# Altium schematic sheet [04] - SX1276.SchDoc: EE-02 - LoRa (SX1276)
size A3; DocumentNumber: 5; SheetNumber: 5; SheetTotal: 5
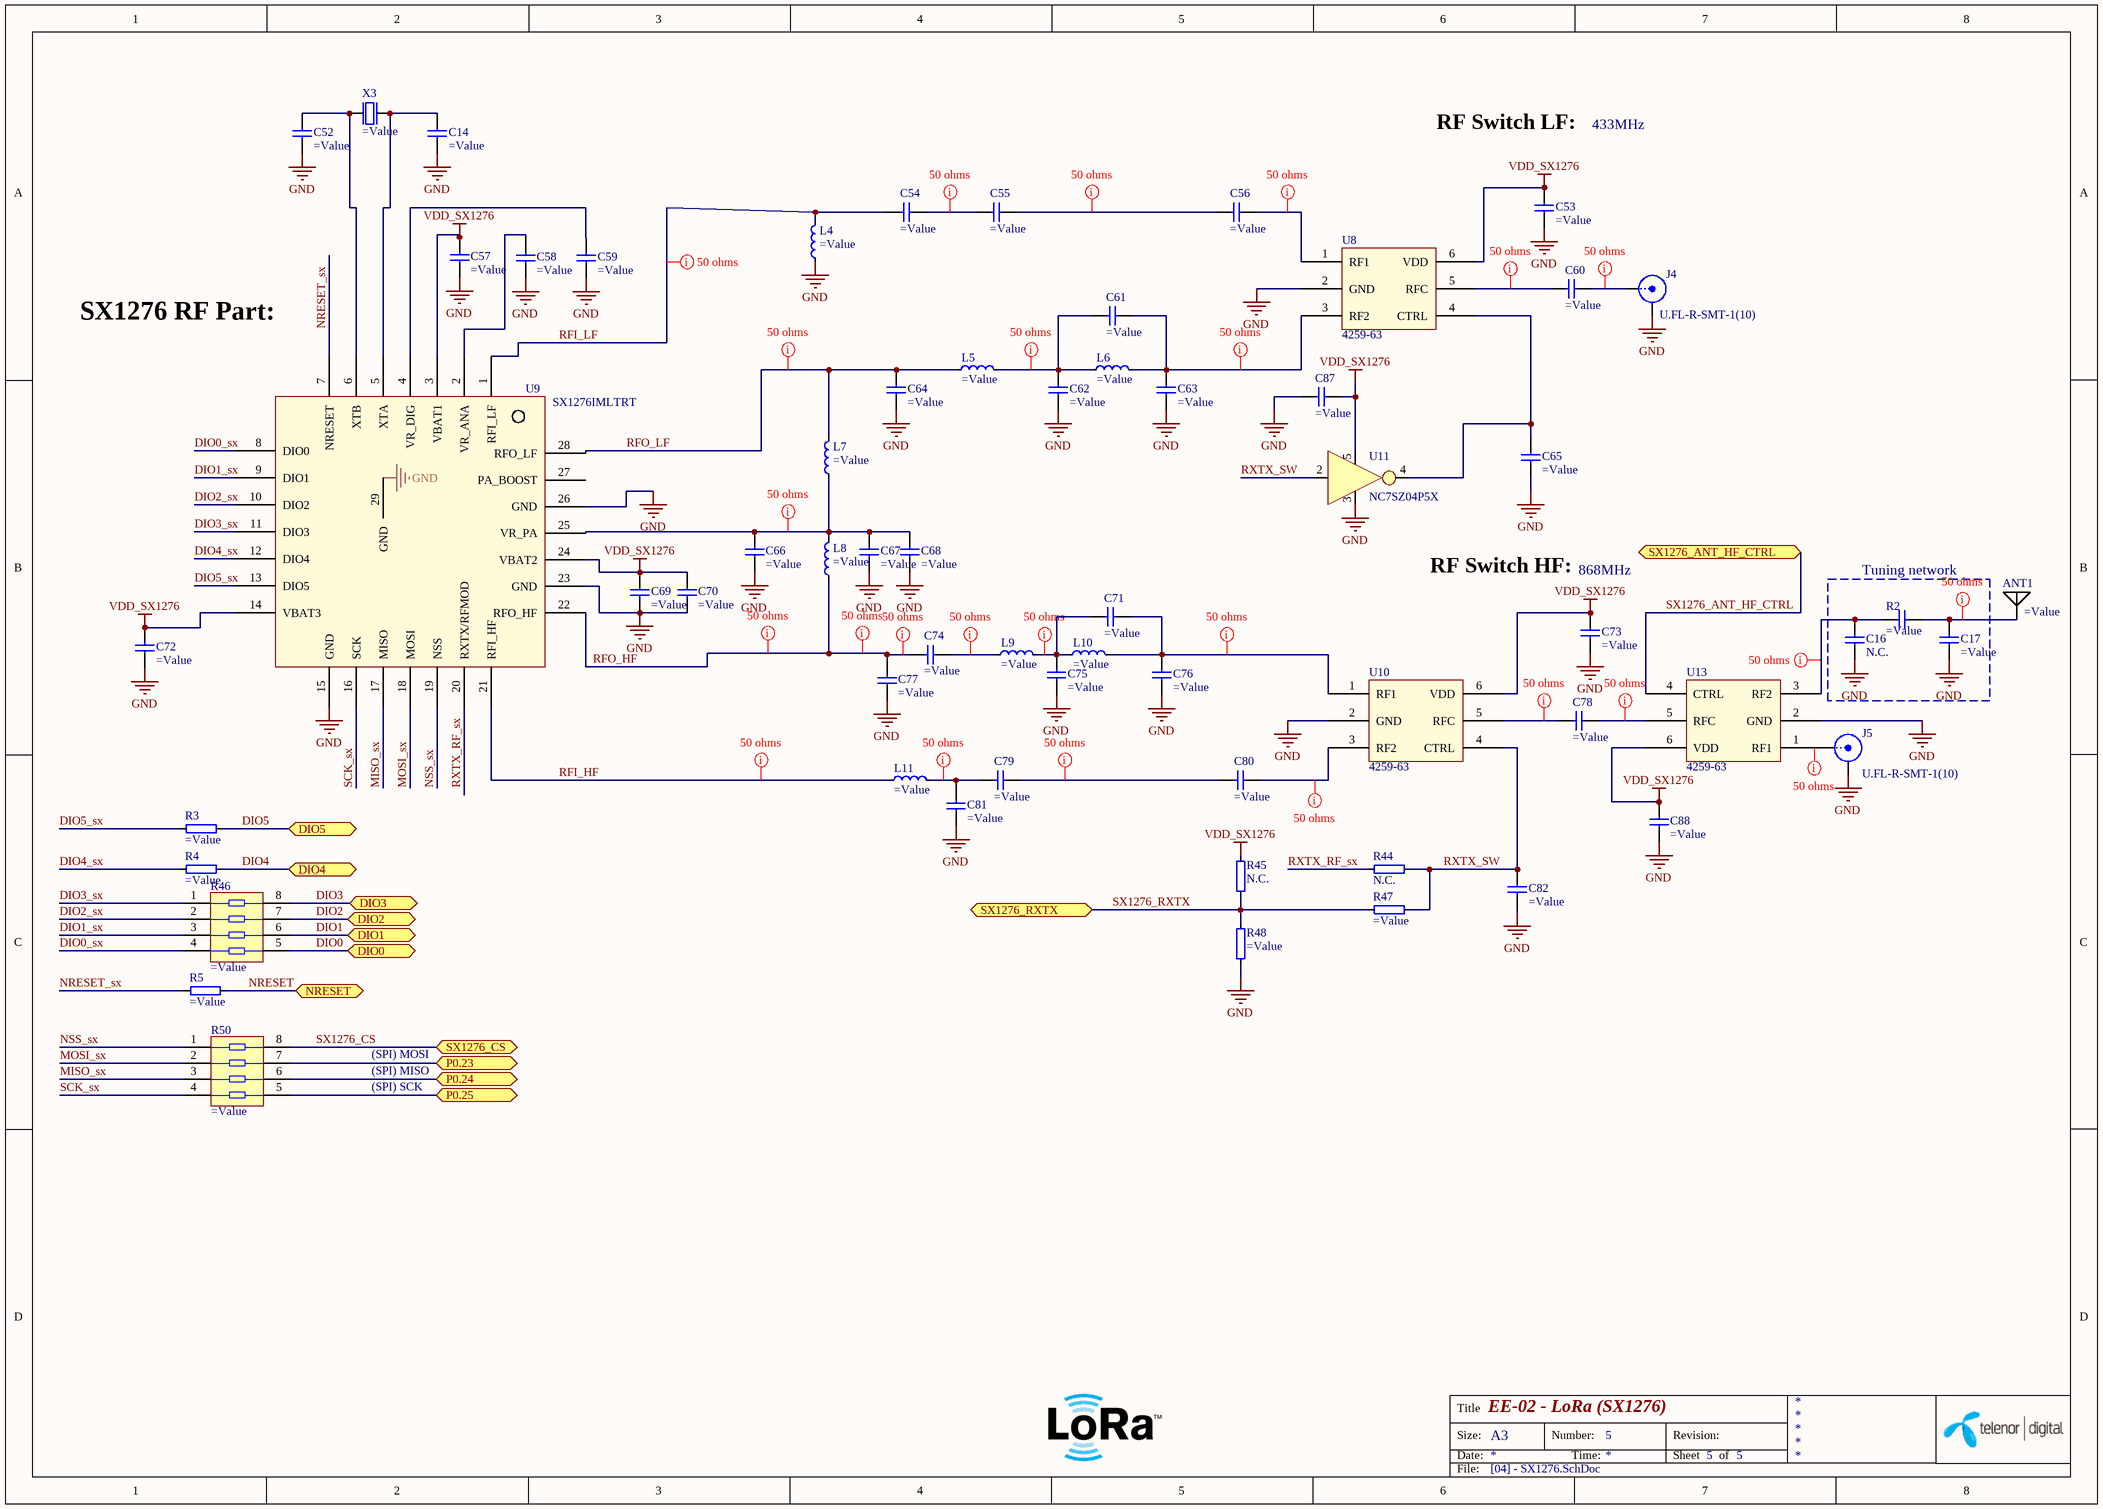
[diagram p0: [04] - SX1276.SchDoc]

## Parts
ANT1  (no value)  [PULSE_W3013_R]
C14  (no value)  [CAPC0603X03L]
C16  N.C.  [CAPC0603X03L]  (no BOM)
C17  (no value)  [CAPC0603X03L]
C52  (no value)  [CAPC0603X03L]
C53  (no value)  [CAPC0603X03L]
C54  (no value)  [CAPC0603X03L]
C55  (no value)  [CAPC0603X03L]
C56  (no value)  [CAPC0603X03L]
C57  (no value)  [CAPC0603X03L]
C58  (no value)  [CAPC0603X03L]
C59  (no value)  [CAPC0603X03L]
C60  (no value)  [CAPC0603X03L]
C61  (no value)  [CAPC0603X03L]
C62  (no value)  [CAPC0603X03L]
C63  (no value)  [CAPC0603X03L]
C64  (no value)  [CAPC0603X03L]
C65  (no value)  [CAPC0603X03L]
C66  (no value)  [CAPC0603X03L]
C67  (no value)  [CAPC0603X03L]
C68  (no value)  [CAPC0603X03L]
C69  (no value)  [CAPC0603X03L]
C70  (no value)  [CAPC0603X03L]
C71  (no value)  [CAPC0603X03L]
C72  (no value)  [CAPC0603X03L]
C73  (no value)  [CAPC0603X03L]
C74  (no value)  [CAPC0603X03L]
C75  (no value)  [CAPC0603X03L]
C76  (no value)  [CAPC0603X03L]
C77  (no value)  [CAPC0603X03L]
C78  (no value)  [CAPC0603X03L]
C79  (no value)  [CAPC0603X03L]
C80  (no value)  [CAPC0603X03L]
C81  (no value)  [CAPC0603X03L]
C82  (no value)  [CAPC0603X03L]
C87  (no value)  [CAPC0603X03L]
C88  (no value)  [CAPC0603X03L]
J4  U.FL-R-SMT-1(10)  [COAXIAL-UFL]
J5  U.FL-R-SMT-1(10)  [COAXIAL-UFL]
L4  (no value)  [INDC1005X04L]
L5  (no value)  [INDC1005X04L]
L6  (no value)  [INDC1005X04L]
L7  (no value)  [INDC1005X04L]
L8  (no value)  [INDC1005X04L]
L9  (no value)  [INDC1005X04L]
L10  (no value)  [INDC1005X04L]
L11  (no value)  [INDC1005X04L]
R2  (no value)  [CAPC0603X03L]
R3  (no value)  [RESC0603X03L]
R4  (no value)  [RESC0603X03L]
R5  (no value)  [RESC0603X03L]
R44  N.C.  [RESC0603X03LNC]
R45  N.C.  [RESC0603X03LNC]
R46  (no value)  [EXB18V]
R47  (no value)  [RESC0603X03L]
R48  (no value)  [RESC0603X03L]
R50  (no value)  [EXB18V]
U8  4259-63  [SC70-6]
U9  SX1276IMLTRT  [vqfn28_6x6mm]
U10  4259-63  [SC70-6]
U11  NC7SZ04P5X  [SC70-5]
U13  4259-63  [SC70-6]
X3  (no value)  [nd2520da]

## Blocks framed on the sheet
Tuning network: C16 C17 R2

## Ports
DIO0, DIO1, DIO2, DIO3, DIO4, DIO5, NRESET, P0.23 (bidir), P0.24 (bidir), P0.25 (bidir), SX1276_ANT_HF_CTRL, SX1276_CS, SX1276_RXTX

## Nets
GND: ANT1.2(GND) ANT1.3(GND) C14.1 C16.1 C17.1 C52.1 C53.1 C57.1 C58.1 C59.1 C62.1 C63.1 C64.1 C65.1 C66.1 C67.1 C68.1 C69.1 C70.1 C72.1 C73.1 C75.1 C76.1 C77.1 C81.1 C82.1 C87.1 C88.1 J4.2(GND) J5.2(GND) L4.1 R48.2 U8.2(GND) U9.15(GND) U9.23(GND) U9.26(GND) U9.29(GND) U10.2(GND) U11.3(GND) U13.2(GND) X3.2 X3.4
VDD_SX1276: C53.2 C57.2 C69.2 C70.2 C72.2 C73.2 C87.2 C88.2 R45.2 U8.6(VDD) U9.3(VBAT1) U9.14(VBAT3) U9.24(VBAT2) U10.6(VDD) U11.5(VCC) U13.6(VDD)
DIO0: R46.5 ; port DIO0
DIO0_sx: R46.4 U9.8(DIO0)
DIO1: R46.6 ; port DIO1
DIO1_sx: R46.3 U9.9(DIO1)
DIO2: R46.7 ; port DIO2
DIO2_sx: R46.2 U9.10(DIO2)
DIO3: R46.8 ; port DIO3
DIO3_sx: R46.1 U9.11(DIO3)
DIO4: R4.2 ; port DIO4
DIO4_sx: R4.1 U9.12(DIO4)
DIO5: R3.2 ; port DIO5
DIO5_sx: R3.1 U9.13(DIO5)
MISO_sx: R50.3 U9.17(MISO)
MOSI_sx: R50.2 U9.18(MOSI)
NRESET: R5.2 ; port NRESET
NRESET_sx: R5.1 U9.7(NRESET)
NSS_sx: R50.1 U9.19(NSS)
P0.23: R50.7 ; port P0.23
P0.24: R50.6 ; port P0.24
P0.25: R50.5 ; port P0.25
RFI_HF: L11.1 U9.21(RFI_HF)
RFI_LF: C54.1 L4.2 U9.1(RFI_LF)
RFO_HF: C74.2 C77.2 L8.1 U9.22(RFO_HF)
RFO_LF: C64.2 L5.1 L7.2 U9.28(RFO_LF)
RXTX_RF_sx: R44.1 U9.20(RXTX/RFMOD)
RXTX_SW: C82.2 R44.2 R47.2 U10.4(CTRL) U11.2(A)
SCK_sx: R50.4 U9.16(SCK)
SX1276_ANT_HF_CTRL: U13.4(CTRL) ; port SX1276_ANT_HF_CTRL
SX1276_CS: R50.8 ; port SX1276_CS
SX1276_RXTX: R45.1 R47.1 R48.1 ; port SX1276_RXTX
NetANT1_1: ANT1.1(Feed) C17.2 R2.2
NetC14_2: C14.2 U9.5(XTA) X3.3(out)
NetC16_2: C16.2 R2.1 U13.3(RF2)
NetC52_2: C52.2 U9.6(XTB) X3.1(inp)
NetC54_2: C54.2 C55.2
NetC55_1: C55.1 C56.2
NetC56_1: C56.1 U8.1(RF1)
NetC58_2: C58.2 U9.2(VR_ANA)
NetC59_2: C59.2 U9.4(VR_DIG)
NetC60_1: C60.1 J4.1(Signal)
NetC60_2: C60.2 U8.5(RFC)
NetC61_1: C61.1 C62.2 L5.2 L6.1
NetC61_2: C61.2 C63.2 L6.2 U8.3(RF2)
NetC65_2: C65.2 U8.4(CTRL) U11.4(Y)
NetC66_2: C66.2 C67.2 C68.2 L7.1 L8.2 U9.25(VR_PA)
NetC71_1: C71.1 C75.2 L9.2 L10.1
NetC71_2: C71.2 C76.2 L10.2 U10.1(RF1)
NetC74_1: C74.1 L9.1
NetC78_1: C78.1 U13.5(RFC)
NetC78_2: C78.2 U10.5(RFC)
NetC79_1: C79.1 C80.2
NetC79_2: C79.2 C81.2 L11.2
NetC80_1: C80.1 U10.3(RF2)
NetJ5_1: J5.1(Signal) U13.1(RF1)

Not connected (* = marked no-connect by the designer): U9 27(PA_BOOST)

## Layout directives
net class 50 ohms impedance: (no net found under the mark), NetANT1_1, NetC16_2, NetC54_2, NetC55_1, NetC56_1, NetC60_1, NetC60_2, NetC61_1, NetC61_2, NetC66_2, NetC71_1, NetC71_2, NetC74_1, NetC78_1, NetC78_2, NetC79_1, NetC79_2, NetC80_1, RFI_HF, RFI_LF, RFO_HF, RFO_LF

## Notes on the sheet
- RF Switch LF:
- 433MHz
- SX1276 RF Part:
- RF Switch HF:
- (near C73) 868MHz
- (SPI) MOSI
- (SPI) SCK
- (SPI) MISO
- Title
- Size:
- Date:
- A3
- Number:
- Time:
- Revision:
- Sheet
- of
- File:

## Library data of the parts
ANT1 = W3013: ANTENNA CERAMIC ISM 868MHZ; Manufacturer: Pulse Electronics Corporation; Frequency Group: UHF (300 MHz ~ 1 GHz); Frequency Range: 868MHz ~ 870MHz; Antenna Type: Chip; Number of Bands: 1; Return Loss: -10dB; Gain: 1.4dBi; Value: W3013; Supplier 1: Digi-Key; Manufacturer Part Number: W3013; RoHS: RoHS Compliant; Category: RF/IF and RFID; Stock 1: 2216; Pricing 1: 1=1.75, 10=1.584, 25=1.4192, 100=1.276, 250=1.133 (USD); Packaging: Digi-Reel®; Frequency (Center/Band): 868MHz; VSWR: -; Power - Max: -; Features: -; Termination: Solder; Ingress Protection: -; Mounting Type: Surface Mount; Height (Max): 0.157" (4.00mm); Applications: -; Supplier Part Number 1: 553-1677-6-ND; Part Status: Active; ComponentLink1URL: http://productfinder.pulseeng.com/products/datasheets/W3013.pdf; ComponentLink1Description: http://productfinder.pulseeng.com/products/datasheets/W3013.pdf
C14 C52 = GRM0335C1H150GA01D: CAP CER 15PF 50V NP0 0201; Manufacturer: Murata Electronics North America; Tolerance: ±2%; Temperature Coefficient: C0G, NP0; Supplier 1: Digi-Key; Manufacturer Part Number: GRM0335C1H150GA01D; RoHS: RoHS Compliant; Category: Capacitors; Stock 1: 750; Pricing 1: 1=0.1, 10=0.014, 50=0.0078, 100=0.0066, 250=0.0054, 500=0.00462, 1000=0.0036, 5000=0.003 (USD); Packaging: Digi-Reel®; Capacitance: 15pF; Voltage - Rated: 50V; Mounting Type: Surface Mount, MLCC; Operating Temperature: -55°C ~ 125°C; Applications: General Purpose; Ratings: -; Package / Case: 0201 (0603 Metric); Size / Dimension: 0.024" L x 0.012" W (0.60mm x 0.30mm); Height - Seated (Max): -; Thickness (Max): 0.013" (0.33mm); Lead Spacing: -; Features: -; Lead Style: -; ComponentLink1URL: http://www.murata.com/~/media/webrenewal/support/library/catalog/products/capacitor/mlcc/c02e.pdf; ComponentLink1Description: http://www.murata.com/~/media/webrenewal/support/library/catalog/products/capacitor/mlcc/c02e.pdf; Supplier Part Number 1: 490-11309-6-ND; Value: 15pF; Part Status: Active; Failure Rate: *
C16 = CAP_0201-NC: Capacitor, 0201, N.C.; Part Number: C0201-NC; Artikkelnr Noca: N.A.; Manufacturer: *; Manufacturer Part Number: *; Datasheet: *; LatestRevisionDate: 2016-11-04; Pin Count: 2; Publisher: Telenor Digital; Published: 2016-11-04; Value: N.C.; Note: *; Supplier: *; Supplier part number: *; 2nd source Supplier: *; 2nd source part number: *; Footprint Doc: 0201; Artikkelnr Simpro: N.A.
C17 = 250R05L100GV4T: CAP CER 10PF 25V NP0 0201; Manufacturer: Johanson Technology Inc.; Tolerance: ±2%; Temperature Coefficient: C0G, NP0; Manufacturer Part Number: 250R05L100GV4T; Value: 10pF; Supplier 1: Digi-Key; RoHS: RoHS Compliant; Category: Capacitors; Stock 1: 18246; Pricing 1: 1=0.23, 10=0.16, 25=0.1172, 50=0.0958, 100=0.0809, 250=0.06596, 500=0.05532, 1000=0.04894, 5000=0.04256 (USD); Packaging: Digi-Reel®; Part Status: Active; Capacitance: 10pF; Voltage - Rated: 25V; Operating Temperature: -55°C ~ 125°C; Features: High Q, Low Loss; Ratings: -; Applications: RF, Microwave, High Frequency; Mounting Type: Surface Mount, MLCC; Package / Case: 0201 (0603 Metric); Size / Dimension: 0.024" L x 0.012" W (0.60mm x 0.30mm); Height - Seated (Max): -; Thickness (Max): 0.013" (0.33mm); Lead Spacing: -; Lead Style: -; ComponentLink1URL: http://www.johansontechnology.com/downloads/JTI-CAT-MLCC-HighQ.pdf; ComponentLink1Description: http://www.johansontechnology.com/downloads/JTI-CAT-MLCC-HighQ.pdf; Supplier Part Number 1: 712-1204-6-ND
C53 C65 C73 C82 C88 = GRM033R71H102KA12D: CAP CER 1NF 50V X7R 0201; Manufacturer: Murata Electronics North America; Tolerance: ±10%; Supplier 1: Digi-Key; Manufacturer Part Number: GRM033R71H102KA12D; RoHS: RoHS Compliant; Category: Capacitors; Stock 1: 132650; Pricing 1: 1=0.1, 10=0.012, 50=0.0066, 100=0.0055, 250=0.00452, 500=0.00386, 1000=0.003, 5000=0.0025 (USD); Packaging: Digi-Reel®; Capacitance: 1nF; Voltage - Rated: 50V; Temperature Coefficient: X7R; Mounting Type: Surface Mount, MLCC; Operating Temperature: -55°C ~ 125°C; Applications: General Purpose; Ratings: -; Package / Case: 0201 (0603 Metric); Size / Dimension: 0.024" L x 0.012" W (0.60mm x 0.30mm); Height - Seated (Max): -; Thickness (Max): 0.013" (0.33mm); Lead Spacing: -; Features: -; Lead Style: -; ComponentLink1URL: http://www.murata.com/~/media/webrenewal/support/library/catalog/products/capacitor/mlcc/c02e.pdf; ComponentLink1Description: http://www.murata.com/~/media/webrenewal/support/library/catalog/products/capacitor/mlcc/c02e.pdf; Supplier Part Number 1: 490-10682-6-ND; Value: 1nF; Part Status: Active; Failure Rate: *
C54 C64 C75 = GRM0335C1H4R7BA01D: CAP CER 4.7PF 50V NP0 0201; Manufacturer: Murata Electronics North America; Tolerance: ±0.1pF; Temperature Coefficient: C0G, NP0; Supplier 1: Digi-Key; Manufacturer Part Number: GRM0335C1H4R7BA01D; RoHS: RoHS Compliant; Category: Capacitors; Stock 1: 70150; Pricing 1: 1=0.1, 10=0.011, 50=0.0058, 100=0.005, 250=0.00404, 500=0.00346, 1000=0.0027, 5000=0.00225 (USD); Packaging: Digi-Reel®; Capacitance: 4.7pF; Voltage - Rated: 50V; Mounting Type: Surface Mount, MLCC; Operating Temperature: -55°C ~ 125°C; Applications: General Purpose; Ratings: -; Package / Case: 0201 (0603 Metric); Size / Dimension: 0.024" L x 0.012" W (0.60mm x 0.30mm); Height - Seated (Max): -; Thickness (Max): 0.013" (0.33mm); Lead Spacing: -; Features: -; Lead Style: -; ComponentLink1URL: http://www.murata.com/~/media/webrenewal/support/library/catalog/products/capacitor/mlcc/c02e.pdf; ComponentLink1Description: http://www.murata.com/~/media/webrenewal/support/library/catalog/products/capacitor/mlcc/c02e.pdf; Supplier Part Number 1: 490-11332-6-ND; Value: 4.7pF; Part Status: Active; Failure Rate: *
C55 C56 C60 C67-C69 C78-C80 = GRM0335C1H470JA01D: CAP CER 47PF 50V NP0 0201; Manufacturer: Murata Electronics North America; Tolerance: ±5%; Temperature Coefficient: C0G, NP0; Supplier 1: Digi-Key; Manufacturer Part Number: GRM0335C1H470JA01D; RoHS: RoHS Compliant; Category: Capacitors; Stock 1: 174645; Pricing 1: 1=0.1, 10=0.011, 50=0.0058, 100=0.005, 250=0.00404, 500=0.00346, 1000=0.0027, 5000=0.00225 (USD); Packaging: Digi-Reel®; Capacitance: 47pF; Voltage - Rated: 50V; Mounting Type: Surface Mount, MLCC; Operating Temperature: -55°C ~ 125°C; Applications: General Purpose; Ratings: -; Package / Case: 0201 (0603 Metric); Size / Dimension: 0.024" L x 0.012" W (0.60mm x 0.30mm); Height - Seated (Max): -; Thickness (Max): *; Lead Spacing: -; Features: -; Lead Style: -; ComponentLink1URL: http://www.murata.com/~/media/webrenewal/support/library/catalog/products/capacitor/mlcc/c02e.pdf; ComponentLink1Description: http://www.murata.com/~/media/webrenewal/support/library/catalog/products/capacitor/mlcc/c02e.pdf; Supplier Part Number 1: 490-6129-6-ND; Value: 47pF; Part Status: Active; Failure Rate: *
C57-C59 C70 C72 C87 = GRM033R61C104KE84D: CAP CER 0.1UF 16V X5R 0201; Manufacturer: Murata Electronics North America; Capacitance: 0.10µF; Tolerance: ±10%; Value: 0.10µF; Supplier 1: Digi-Key; Manufacturer Part Number: GRM033R61C104KE84D; RoHS: RoHS Compliant; Category: Capacitors; Stock 1: 0; Pricing 1: 1=0.1, 10=0.025, 50=0.0136, 100=0.0116, 250=0.00944, 500=0.00808, 1000=0.0063, 5000=0.00525 (USD); Packaging: Digi-Reel®; Voltage - Rated: 16V; Temperature Coefficient: X5R; Mounting Type: Surface Mount, MLCC; Operating Temperature: -55°C ~ 85°C; Applications: General Purpose; Ratings: -; Package / Case: 0201 (0603 Metric); Size / Dimension: 0.024" L x 0.012" W (0.60mm x 0.30mm); Height - Seated (Max): -; Thickness (Max): 0.013" (0.33mm); Lead Spacing: -; Features: Derating Recommended; Lead Style: -; ComponentLink1URL: http://www.murata.com/~/media/webrenewal/support/library/catalog/products/capacitor/mlcc/c02e.pdf; ComponentLink1Description: http://www.murata.com/~/media/webrenewal/support/library/catalog/products/capacitor/mlcc/c02e.pdf; Supplier Part Number 1: 490-9985-6-ND; Part Status: Active; Failure Rate: *
C61 = GRM0335C1H2R7BA01D: CAP CER 2.7PF 50V NP0 0201; Manufacturer: Murata Electronics North America; Tolerance: ±0.1pF; Temperature Coefficient: C0G, NP0; Supplier 1: Digi-Key; Manufacturer Part Number: GRM0335C1H2R7BA01D; RoHS: RoHS Compliant; Category: Capacitors; Stock 1: 26213; Pricing 1: 1=0.1, 10=0.014, 50=0.0078, 100=0.0066, 250=0.0054, 500=0.00462, 1000=0.0036, 5000=0.003 (USD); Packaging: Digi-Reel®; Capacitance: 2.7pF; Voltage - Rated: 50V; Mounting Type: Surface Mount, MLCC; Operating Temperature: -55°C ~ 125°C; Applications: General Purpose; Ratings: -; Package / Case: 0201 (0603 Metric); Size / Dimension: 0.024" L x 0.012" W (0.60mm x 0.30mm); Height - Seated (Max): -; Thickness (Max): 0.013" (0.33mm); Lead Spacing: -; Features: -; Lead Style: -; ComponentLink1URL: http://www.murata.com/~/media/webrenewal/support/library/catalog/products/capacitor/mlcc/c02e.pdf; ComponentLink1Description: http://www.murata.com/~/media/webrenewal/support/library/catalog/products/capacitor/mlcc/c02e.pdf; Supplier Part Number 1: 490-11322-6-ND; Value: 2.7pF; Part Status: Active; Failure Rate: *
C62 C63 = GRM0335C1H6R8CA01D: CAP CER 6.8PF 50V NP0 0201; Manufacturer: Murata Electronics North America; Tolerance: ±0.25pF; Temperature Coefficient: C0G, NP0; Supplier 1: Digi-Key; Manufacturer Part Number: GRM0335C1H6R8CA01D; RoHS: RoHS Compliant; Category: Capacitors; Stock 1: 184512; Pricing 1: 1=0.1, 10=0.011, 50=0.0058, 100=0.005, 250=0.00404, 500=0.00346, 1000=0.0027, 5000=0.00225 (USD); Packaging: Digi-Reel®; Capacitance: 6.8pF; Voltage - Rated: 50V; Mounting Type: Surface Mount, MLCC; Operating Temperature: -55°C ~ 125°C; Applications: General Purpose; Ratings: -; Package / Case: 0201 (0603 Metric); Size / Dimension: 0.024" L x 0.012" W (0.60mm x 0.30mm); Height - Seated (Max): -; Thickness (Max): 0.013" (0.33mm); Lead Spacing: -; Features: -; Lead Style: -; ComponentLink1URL: http://www.murata.com/~/media/webrenewal/support/library/catalog/products/capacitor/mlcc/c02e.pdf; ComponentLink1Description: http://www.murata.com/~/media/webrenewal/support/library/catalog/products/capacitor/mlcc/c02e.pdf; Supplier Part Number 1: 490-11341-6-ND; Value: 6.8pF; Part Status: Active; Failure Rate: *
C66 = GRM033R61E103KA12D: CAP CER 10NF 25V X5R 0201; Manufacturer: Murata Electronics North America; Tolerance: ±10%; Supplier 1: Digi-Key; Manufacturer Part Number: GRM033R61E103KA12D; RoHS: RoHS Compliant; Category: Capacitors; Stock 1: 1209439; Pricing 1: 1=0.1, 10=0.012, 50=0.0066, 100=0.0055, 250=0.00452, 500=0.00386, 1000=0.003, 5000=0.0025 (USD); Packaging: Digi-Reel®; Capacitance: 10nF; Voltage - Rated: 25V; Temperature Coefficient: X5R; Mounting Type: Surface Mount, MLCC; Operating Temperature: -55°C ~ 85°C; Applications: General Purpose; Ratings: -; Package / Case: 0201 (0603 Metric); Size / Dimension: 0.024" L x 0.012" W (0.60mm x 0.30mm); Height - Seated (Max): -; Thickness (Max): 0.013" (0.33mm); Lead Spacing: -; Features: Derating Recommended; Lead Style: -; ComponentLink1URL: http://www.murata.com/~/media/webrenewal/support/library/catalog/products/capacitor/mlcc/c02e.pdf; ComponentLink1Description: http://www.murata.com/~/media/webrenewal/support/library/catalog/products/capacitor/mlcc/c02e.pdf; Supplier Part Number 1: 490-7194-6-ND; Value: 10nF; Part Status: Active; Failure Rate: *
C71 = GRM0335C1H1R2BA01D: CAP CER 1.2PF 50V NP0 0201; Manufacturer: Murata Electronics North America; Tolerance: ±0.1pF; Temperature Coefficient: C0G, NP0; Supplier 1: Digi-Key; Manufacturer Part Number: GRM0335C1H1R2BA01D; RoHS: RoHS Compliant; Category: Capacitors; Stock 1: 29460; Pricing 1: 1=0.1, 10=0.014, 50=0.0078, 100=0.0066, 250=0.0054, 500=0.00462, 1000=0.0036, 5000=0.003 (USD); Packaging: Digi-Reel®; Capacitance: 1.2pF; Voltage - Rated: 50V; Mounting Type: Surface Mount, MLCC; Operating Temperature: -55°C ~ 125°C; Applications: General Purpose; Ratings: -; Package / Case: 0201 (0603 Metric); Size / Dimension: 0.024" L x 0.012" W (0.60mm x 0.30mm); Height - Seated (Max): -; Thickness (Max): 0.013" (0.33mm); Lead Spacing: -; Features: -; Lead Style: -; ComponentLink1URL: http://www.murata.com/~/media/webrenewal/support/library/catalog/products/capacitor/mlcc/c02e.pdf; ComponentLink1Description: http://www.murata.com/~/media/webrenewal/support/library/catalog/products/capacitor/mlcc/c02e.pdf; Supplier Part Number 1: 490-9661-6-ND; Value: 1.2pF; Part Status: Active; Failure Rate: *
C74 = GRM0335C1H330GA01D: CAP CER 33PF 50V NP0 0201; Manufacturer: Murata Electronics North America; Tolerance: ±2%; Temperature Coefficient: C0G, NP0; Supplier 1: Digi-Key; Manufacturer Part Number: GRM0335C1H330GA01D; RoHS: RoHS Compliant; Category: Capacitors; Stock 1: 48655; Pricing 1: 1=0.1, 10=0.014, 50=0.0078, 100=0.0066, 250=0.0054, 500=0.00462, 1000=0.0036, 5000=0.003 (USD); Packaging: Digi-Reel®; Capacitance: 33pF; Voltage - Rated: 50V; Mounting Type: Surface Mount, MLCC; Operating Temperature: -55°C ~ 125°C; Applications: General Purpose; Ratings: -; Package / Case: 0201 (0603 Metric); Size / Dimension: 0.024" L x 0.012" W (0.60mm x 0.30mm); Height - Seated (Max): -; Thickness (Max): 0.013" (0.33mm); Lead Spacing: -; Features: -; Lead Style: -; ComponentLink1URL: http://www.murata.com/~/media/webrenewal/support/library/catalog/products/capacitor/mlcc/c02e.pdf; ComponentLink1Description: http://www.murata.com/~/media/webrenewal/support/library/catalog/products/capacitor/mlcc/c02e.pdf; Supplier Part Number 1: 490-11325-6-ND; Value: 33pF; Part Status: Active; Failure Rate: *
C76 = GRM0335C1H1R8BA01D: CAP CER 1.8PF 50V NP0 0201; Manufacturer: Murata Electronics North America; Tolerance: ±0.1pF; Temperature Coefficient: C0G, NP0; Supplier 1: Digi-Key; Manufacturer Part Number: GRM0335C1H1R8BA01D; RoHS: RoHS Compliant; Category: Capacitors; Stock 1: 20450; Pricing 1: 1=0.1, 10=0.014, 50=0.0078, 100=0.0066, 250=0.0054, 500=0.00462, 1000=0.0036, 5000=0.003 (USD); Packaging: Digi-Reel®; Capacitance: 1.8pF; Voltage - Rated: 50V; Mounting Type: Surface Mount, MLCC; Operating Temperature: -55°C ~ 125°C; Applications: General Purpose; Ratings: -; Package / Case: 0201 (0603 Metric); Size / Dimension: 0.024" L x 0.012" W (0.60mm x 0.30mm); Height - Seated (Max): -; Thickness (Max): 0.013" (0.33mm); Lead Spacing: -; Features: -; Lead Style: -; ComponentLink1URL: http://www.murata.com/~/media/webrenewal/support/library/catalog/products/capacitor/mlcc/c02e.pdf; ComponentLink1Description: http://www.murata.com/~/media/webrenewal/support/library/catalog/products/capacitor/mlcc/c02e.pdf; Supplier Part Number 1: 490-11313-6-ND; Value: 1.8pF; Part Status: Active; Failure Rate: *
C77 = GRM0335C1H1R5BA01D: CAP CER 1.5PF 50V NP0 0201; Manufacturer: Murata Electronics North America; Tolerance: ±0.1pF; Temperature Coefficient: C0G, NP0; Supplier 1: Digi-Key; Manufacturer Part Number: GRM0335C1H1R5BA01D; RoHS: RoHS Compliant; Category: Capacitors; Stock 1: 40910; Pricing 1: 1=0.1, 10=0.014, 50=0.0078, 100=0.0066, 250=0.0054, 500=0.00462, 1000=0.0036, 5000=0.003 (USD); Packaging: Digi-Reel®; Capacitance: 1.5pF; Voltage - Rated: 50V; Mounting Type: Surface Mount, MLCC; Operating Temperature: -55°C ~ 125°C; Applications: General Purpose; Ratings: -; Package / Case: 0201 (0603 Metric); Size / Dimension: 0.024" L x 0.012" W (0.60mm x 0.30mm); Height - Seated (Max): -; Thickness (Max): 0.013" (0.33mm); Lead Spacing: -; Features: -; Lead Style: -; ComponentLink1URL: http://www.murata.com/~/media/webrenewal/support/library/catalog/products/capacitor/mlcc/c02e.pdf; ComponentLink1Description: http://www.murata.com/~/media/webrenewal/support/library/catalog/products/capacitor/mlcc/c02e.pdf; Supplier Part Number 1: 490-11311-6-ND; Value: 1.5pF; Part Status: Active; Failure Rate: *
C81 = GRM0335C1H3R3BA01D: CAP CER 3.3PF 50V NP0 0201; Manufacturer: Murata Electronics North America; Tolerance: ±0.1pF; Temperature Coefficient: C0G, NP0; Supplier 1: Digi-Key; Manufacturer Part Number: GRM0335C1H3R3BA01D; RoHS: RoHS Compliant; Category: Capacitors; Stock 1: 48664; Pricing 1: 1=0.1, 10=0.014, 50=0.0078, 100=0.0066, 250=0.0054, 500=0.00462, 1000=0.0036, 5000=0.003 (USD); Packaging: Digi-Reel®; Capacitance: 3.3pF; Voltage - Rated: 50V; Mounting Type: Surface Mount, MLCC; Operating Temperature: -55°C ~ 125°C; Applications: General Purpose; Ratings: -; Package / Case: 0201 (0603 Metric); Size / Dimension: 0.024" L x 0.012" W (0.60mm x 0.30mm); Height - Seated (Max): -; Thickness (Max): 0.013" (0.33mm); Lead Spacing: -; Features: -; Lead Style: -; ComponentLink1URL: http://www.murata.com/~/media/webrenewal/support/library/catalog/products/capacitor/mlcc/c02e.pdf; ComponentLink1Description: http://www.murata.com/~/media/webrenewal/support/library/catalog/products/capacitor/mlcc/c02e.pdf; Supplier Part Number 1: 490-11328-6-ND; Value: 3.3pF; Part Status: Active; Failure Rate: *
J4 J5 = U.FL-R-SMT-1(10): CONN UMC JACK STR 50 OHM SMD; Manufacturer: Hirose Electric Co Ltd; Connector Style: U.FL; Connector Type: Jack, Male Pin; Contact Termination: Solder; Impedance: 50 Ohm; Frequency - Max: 6GHz; Body Material: Phosphor Bronze; Body Finish: Silver; Center Contact Plating: Gold; Dielectric Material: Liquid Crystal Polymer (LCP); Supplier 1: Digi-Key; Manufacturer Part Number: U.FL-R-SMT-1(10); RoHS: RoHS Compliant; Category: Connectors, Interconnects; Stock 1: 124618; Pricing 1: 1=1.15, 10=1.013, 25=0.9532, 50=0.9138, 100=0.8739, 250=0.79448, 500=0.71504, 1000=0.63559 (EUR); Packaging: Digi-Reel®; Shield Termination: Solder; Mounting Type: Surface Mount; Cable Group: -; Fastening Type: Snap-On; Features: -; Housing Color: Silver; Ingress Protection: -; Center Contact Material: Phosphor Bronze; Voltage Rating: -; Operating Temperature: -40°C ~ 90°C; ComponentLink1URL: http://media.digikey.com/pdf/Data%20Sheets/Hirose%20PDFs/UFL%20Series.pdf; ComponentLink1Description: http://media.digikey.com/pdf/Data%20Sheets/Hirose%20PDFs/UFL%20Series.pdf; Supplier Part Number 1: H11891DKR-ND
L4 = LQG15HS18NJ02D: FIXED IND 18NH 300MA 360 MOHM; Manufacturer: Murata Electronics North America; Type: Multilayer; Material - Core: Air; Tolerance: ±5%; Shielding: Unshielded; DC Resistance (DCR): 360 mOhm Max; Q @ Freq: 8 @ 100MHz; Frequency - Self Resonant: 2.2GHz; Frequency - Test: 100MHz; Supplier 1: Digi-Key; Manufacturer Part Number: LQG15HS18NJ02D; RoHS: RoHS Compliant; Category: Inductors, Coils, Chokes; Stock 1: 165090; Pricing 1: 1=0.09, 10=0.052, 25=0.0464, 50=0.0402, 100=0.0361, 250=0.03352, 500=0.03092, 750=0.02937, 1000=0.02679 (EUR); Packaging: Digi-Reel®; Inductance: 18nH; Current Rating: 300mA; Current - Saturation: -; Ratings: -; Operating Temperature: -55°C ~ 125°C; Mounting Type: Surface Mount; Package / Case: 0402 (1005 Metric); Size / Dimension: 0.039" L x 0.020" W (1.00mm x 0.50mm); Height - Seated (Max): 0.022" (0.55mm); ComponentLink1URL: http://search.murata.co.jp/Ceramy/image/img/PDF/ENG/L0075S0083LQG15HS.pdf; ComponentLink1Description: http://search.murata.co.jp/Ceramy/image/img/PDF/ENG/L0075S0083LQG15HS.pdf; Supplier Part Number 1: 490-2626-6-ND; Value: 18nH
L5 = LQG15HS15NJ02D: FIXED IND 15NH 300MA 320 MOHM; Manufacturer: Murata Electronics North America; Type: Multilayer; Material - Core: Air; Tolerance: ±5%; Shielding: Unshielded; DC Resistance (DCR): 320 mOhm Max; Q @ Freq: 8 @ 100MHz; Frequency - Self Resonant: 2.5GHz; Frequency - Test: 100MHz; Supplier 1: Digi-Key; Manufacturer Part Number: LQG15HS15NJ02D; RoHS: RoHS Compliant; Category: Inductors, Coils, Chokes; Stock 1: 47142; Pricing 1: 1=0.09, 10=0.052, 25=0.0464, 50=0.0402, 100=0.0361, 250=0.03352, 500=0.03092, 750=0.02937, 1000=0.02679 (EUR); Packaging: Digi-Reel®; Inductance: 15nH; Current Rating: 300mA; Current - Saturation: -; Ratings: -; Operating Temperature: -55°C ~ 125°C; Mounting Type: Surface Mount; Package / Case: 0402 (1005 Metric); Size / Dimension: 0.039" L x 0.020" W (1.00mm x 0.50mm); Height - Seated (Max): 0.022" (0.55mm); ComponentLink1URL: http://search.murata.co.jp/Ceramy/image/img/PDF/ENG/L0075S0083LQG15HS.pdf; ComponentLink1Description: http://search.murata.co.jp/Ceramy/image/img/PDF/ENG/L0075S0083LQG15HS.pdf; Value: 15nH; Supplier Part Number 1: 490-2625-6-ND
L6 = LQG15HS12NJ02D: FIXED IND 12NH 300MA 280 MOHM; Manufacturer: Murata Electronics North America; Type: Multilayer; Material - Core: Air; Tolerance: ±5%; Shielding: Unshielded; DC Resistance (DCR): 280 mOhm Max; Q @ Freq: 8 @ 100MHz; Frequency - Self Resonant: 3GHz; Frequency - Test: 100MHz; Supplier 1: Digi-Key; Manufacturer Part Number: LQG15HS12NJ02D; RoHS: RoHS Compliant; Category: Inductors, Coils, Chokes; Stock 1: 77424; Pricing 1: 1=0.09, 10=0.052, 25=0.0464, 50=0.0402, 100=0.0361, 250=0.03352, 500=0.03092, 750=0.02937, 1000=0.02679 (EUR); Packaging: Digi-Reel®; Inductance: 12nH; Current Rating: 300mA; Current - Saturation: -; Ratings: -; Operating Temperature: -55°C ~ 125°C; Mounting Type: Surface Mount; Package / Case: 0402 (1005 Metric); Size / Dimension: 0.039" L x 0.020" W (1.00mm x 0.50mm); Height - Seated (Max): 0.022" (0.55mm); ComponentLink1URL: http://search.murata.co.jp/Ceramy/image/img/PDF/ENG/L0075S0083LQG15HS.pdf; ComponentLink1Description: http://search.murata.co.jp/Ceramy/image/img/PDF/ENG/L0075S0083LQG15HS.pdf; Supplier Part Number 1: 490-2624-6-ND; Value: 12nH
L7 = LQG15HS82NJ02D: FIXED IND 82NH 150MA 1.2 OHM SMD; Manufacturer: Murata Electronics North America; Type: Multilayer; Material - Core: Air; Tolerance: ±5%; Shielding: Unshielded; DC Resistance (DCR): 1.2 Ohm Max; Q @ Freq: 8 @ 100MHz; Frequency - Self Resonant: 700MHz; Frequency - Test: 100MHz; Supplier 1: Digi-Key; Manufacturer Part Number: LQG15HS82NJ02D; RoHS: RoHS Compliant; Category: Inductors, Coils, Chokes; Stock 1: 28103; Pricing 1: 1=0.09, 10=0.061, 25=0.0548, 50=0.0474, 100=0.0425, 250=0.03948, 500=0.03646, 750=0.03464, 1000=0.0316 (EUR); Packaging: Digi-Reel®; Inductance: 82nH; Current Rating: 150mA; Current - Saturation: -; Ratings: -; Operating Temperature: -55°C ~ 125°C; Mounting Type: Surface Mount; Package / Case: 0402 (1005 Metric); Size / Dimension: 0.039" L x 0.020" W (1.00mm x 0.50mm); Height - Seated (Max): 0.022" (0.55mm); ComponentLink1URL: http://search.murata.co.jp/Ceramy/image/img/PDF/ENG/L0075S0083LQG15HS.pdf; ComponentLink1Description: http://search.murata.co.jp/Ceramy/image/img/PDF/ENG/L0075S0083LQG15HS.pdf; Supplier Part Number 1: 490-2634-6-ND; Value: 82nH
L8 = LQW15AN33NJ00D: FIXED IND 33NH 260MA 630 MOHM; Manufacturer: Murata Electronics North America; Type: Wirewound; Material - Core: Non-Magnetic; Tolerance: ±5%; Shielding: Unshielded; DC Resistance (DCR): 630 mOhm Max; Q @ Freq: 25 @ 250MHz; Frequency - Self Resonant: 3.2GHz; Frequency - Test: 100MHz; Supplier 1: Digi-Key; Manufacturer Part Number: LQW15AN33NJ00D; RoHS: RoHS Compliant; Category: Inductors, Coils, Chokes; Stock 1: 51716; Pricing 1: 1=0.15, 10=0.132, 25=0.1192, 50=0.103, 100=0.0925, 250=0.08588, 500=0.07928, 750=0.07532, 1000=0.0687 (EUR); Packaging: Digi-Reel®; Inductance: 33nH; Current Rating: 260mA; Current - Saturation: -; Ratings: -; Operating Temperature: -55°C ~ 125°C; Mounting Type: Surface Mount; Package / Case: 0402 (1005 Metric); Size / Dimension: 0.039" L x 0.020" W (1.00mm x 0.50mm); Height - Seated (Max): 0.024" (0.60mm); ComponentLink1URL: http://search.murata.co.jp/Ceramy/image/img/PDF/ENG/L0075S0080LQW15A_00.pdf; ComponentLink1Description: http://search.murata.co.jp/Ceramy/image/img/PDF/ENG/L0075S0080LQW15A_00.pdf; Supplier Part Number 1: 490-1152-6-ND; Value: 33nH
L9 L11 = LQG15HS10NJ02D: FIXED IND 10NH 300MA 260 MOHM; Manufacturer: Murata Electronics North America; Type: Multilayer; Material - Core: Air; Tolerance: ±5%; Shielding: Unshielded; DC Resistance (DCR): 260 mOhm Max; Q @ Freq: 8 @ 100MHz; Frequency - Self Resonant: 3.4GHz; Frequency - Test: 100MHz; Supplier 1: Digi-Key; Manufacturer Part Number: LQG15HS10NJ02D; RoHS: RoHS Compliant; Category: Inductors, Coils, Chokes; Stock 1: 110764; Pricing 1: 1=0.09, 10=0.052, 25=0.0464, 50=0.0402, 100=0.0361, 250=0.03352, 500=0.03092, 750=0.02937, 1000=0.02679 (EUR); Packaging: Digi-Reel®; Inductance: 10nH; Current Rating: 300mA; Current - Saturation: -; Ratings: -; Operating Temperature: -55°C ~ 125°C; Mounting Type: Surface Mount; Package / Case: 0402 (1005 Metric); Size / Dimension: 0.039" L x 0.020" W (1.00mm x 0.50mm); Height - Seated (Max): 0.022" (0.55mm); ComponentLink1URL: http://search.murata.co.jp/Ceramy/image/img/PDF/ENG/L0075S0083LQG15HS.pdf; ComponentLink1Description: http://search.murata.co.jp/Ceramy/image/img/PDF/ENG/L0075S0083LQG15HS.pdf; Supplier Part Number 1: 490-2623-6-ND; Value: 10nH
L10 = LQG15HS6N2S02D: FIXED IND 6.2NH 300MA 220 MOHM; Manufacturer: Murata Electronics North America; Type: Multilayer; Material - Core: Air; Tolerance: ±0.3nH; Shielding: Unshielded; DC Resistance (DCR): 220 mOhm Max; Q @ Freq: 8 @ 100MHz; Frequency - Self Resonant: 4.5GHz; Frequency - Test: 100MHz; Supplier 1: Digi-Key; Manufacturer Part Number: LQG15HS6N2S02D; RoHS: RoHS Compliant; Category: Inductors, Coils, Chokes; Stock 1: 52721; Pricing 1: 1=0.09, 10=0.052, 25=0.0464, 50=0.0402, 100=0.0361, 250=0.03352, 500=0.03092, 750=0.02937, 1000=0.02679 (EUR); Packaging: Digi-Reel®; Inductance: 6.2nH; Current Rating: 300mA; Current - Saturation: -; Ratings: -; Operating Temperature: -55°C ~ 125°C; Mounting Type: Surface Mount; Package / Case: 0402 (1005 Metric); Size / Dimension: 0.039" L x 0.020" W (1.00mm x 0.50mm); Height - Seated (Max): 0.022" (0.55mm); ComponentLink1URL: http://search.murata.co.jp/Ceramy/image/img/PDF/ENG/L0075S0083LQG15HS.pdf; ComponentLink1Description: http://search.murata.co.jp/Ceramy/image/img/PDF/ENG/L0075S0083LQG15HS.pdf; Supplier Part Number 1: 490-2620-6-ND; Value: 6.2nH
R2 = 250R05L2R2BV4T: CAP CER 2.2PF 25V NP0 0201; Manufacturer: Johanson Technology Inc.; Tolerance: ±0.1pF; Temperature Coefficient: C0G, NP0; Supplier 1: Digi-Key; Manufacturer Part Number: 250R05L2R2BV4T; RoHS: RoHS Compliant; Category: Capacitors; Stock 1: 75089; Pricing 1: 1=0.23, 10=0.16, 25=0.1172, 50=0.0958, 100=0.0809, 250=0.06596, 500=0.05532, 1000=0.04894, 5000=0.04256 (USD); Packaging: Digi-Reel®; Features: High Q, Low Loss; Operating Temperature: -55°C ~ 125°C; Package / Case: 0201 (0603 Metric); Size / Dimension: 0.024" L x 0.012" W (0.60mm x 0.30mm); ComponentLink1URL: http://www.johansontechnology.com/downloads/JTI-CAT-MLCC-HighQ.pdf; ComponentLink1Description: http://www.johansontechnology.com/downloads/JTI-CAT-MLCC-HighQ.pdf; Supplier Part Number 1: 712-1188-6-ND; Value: 2.2pF; Part Status: Active; Height - Seated (Max): -; Capacitance: 2.2pF; Voltage - Rated: 25V; Ratings: -; Applications: RF, Microwave, High Frequency; Mounting Type: Surface Mount, MLCC; Thickness (Max): 0.013" (0.33mm); Lead Spacing: -; Lead Style: -
R3-R5 R47 = RC0201FR-07100RL: RES SMD 100 OHM 1% 1/20W 0201; Manufacturer: Yageo; Resistance (Ohms): 100; Power (Watts): 0.05W, 1/20W; Temperature Coefficient: ±200ppm/°C; Value: 100; Supplier 1: Digi-Key; Manufacturer Part Number: RC0201FR-07100RL; RoHS: RoHS Compliant; Category: Resistors; Stock 1: 295829; Pricing 1: 1=0.1, 10=0.055, 25=0.0396, 100=0.0222, 250=0.01692, 500=0.01354, 1000=0.00997, 2500=0.00865, 5000=0.00715 (USD); Packaging: Digi-Reel®; Part Status: Active; Tolerance: ±1%; Composition: Thick Film; Features: Moisture Resistant; Operating Temperature: -55°C ~ 125°C; Package / Case: 0201 (0603 Metric); Supplier Device Package: 0201; Size / Dimension: 0.024" L x 0.012" W (0.60mm x 0.30mm); Height - Seated (Max): 0.010" (0.26mm); Number of Terminations: 2; Failure Rate: -; ComponentLink1URL: http://www.yageo.com/NewPortal/yageodocoutput?fileName=/pdf/R-Chip/PYu-RC_Group_51_RoHS_L_4.pdf; ComponentLink1Description: http://www.yageo.com/NewPortal/yageodocoutput?fileName=/pdf/R-Chip/PYu-RC_Group_51_RoHS_L_4.pdf; Supplier Part Number 1: 311-100MDKR-ND
R44 R45 = RES_0201: Not mounted; Part Number: R0201-N.C.; Note: Chip Res; Artikkelnr Noca: N.A.; Manufacturer: *; Manufacturer Part Number: *; Datasheet: *; Footprint Doc: 0201; LatestRevisionDate: 2009-05-08; Pin Count: 2; Publisher: Nordic Semiconductor; Published: 2009-05-08; Value: N.C.; Supplier: *; Supplier part number: *; 2nd source Supplier: *; 2nd source part number: *; Artikkelnr Simpro: N.A.
R46 R50 = EXB-18V101JX: RES ARRAY 4 RES 100 OHM 0502; Manufacturer: Panasonic Electronic Components; Circuit Type: Isolated; Resistance (Ohms): 100; Tolerance: ±5%; Number of Resistors: 4; Power Per Element: 31mW; Temperature Coefficient: ±200ppm/°C; Value: 100; Supplier 1: Digi-Key; Manufacturer Part Number: EXB-18V101JX; RoHS: RoHS Compliant; Category: Resistors; Stock 1: 27122; Pricing 1: 1=0.59, 50=0.2296, 100=0.1845, 250=0.14352, 500=0.10824, 1000=0.08364, 5000=0.06232 (USD); Packaging: Digi-Reel®; Number of Pins: 8; Operating Temperature: -55°C ~ 125°C; Applications: -; Mounting Type: Surface Mount; Package / Case: 0502 (1406 Metric), Long Side Terminals; Supplier Device Package: 0502; Size / Dimension: 0.055" L x 0.024" W (1.40mm x 0.60mm); Height: 0.018" (0.45mm); ComponentLink1URL: https://industrial.panasonic.com/cdbs/www-data/pdf/AOC0000/AOC0000CE4.pdf; ComponentLink1Description: https://industrial.panasonic.com/cdbs/www-data/pdf/AOC0000/AOC0000CE4.pdf; Supplier Part Number 1: Y6101DKR-ND; Part Status: Active
R48 = RC0201FR-071KL: RES SMD 1K OHM 1% 1/20W 0201; Manufacturer: Yageo; Power (Watts): 0.05W, 1/20W; Temperature Coefficient: ±200ppm/°C; Supplier 1: Digi-Key; Manufacturer Part Number: RC0201FR-071KL; RoHS: RoHS Compliant; Category: Resistors; Stock 1: 243673; Pricing 1: 1=0.1, 10=0.074, 25=0.054, 100=0.0303, 250=0.02312, 500=0.0185, 1000=0.01361, 2500=0.01182, 5000=0.00976 (USD); Packaging: Digi-Reel®; Resistance (Ohms): 1k; Tolerance: ±1%; Composition: Thick Film; Features: Moisture Resistant; Operating Temperature: -55°C ~ 125°C; Package / Case: 0201 (0603 Metric); Supplier Device Package: 0201; Size / Dimension: 0.024" L x 0.012" W (0.60mm x 0.30mm); Number of Terminations: 2; ComponentLink1URL: http://www.yageo.com/NewPortal/yageodocoutput?fileName=/pdf/R-Chip/PYu-RC_Group_51_RoHS_L_4.pdf; ComponentLink1Description: http://www.yageo.com/NewPortal/yageodocoutput?fileName=/pdf/R-Chip/PYu-RC_Group_51_RoHS_L_4.pdf; Supplier Part Number 1: 311-1KMDKR-ND; Value: 1k; Part Status: Active; Height - Seated (Max): 0.010" (0.26mm); Failure Rate: -
U8 U10 U13 = 4259-63: IC RF SWITCH SPDT 50 OHM SC70-6; Manufacturer: Peregrine Semiconductor; Frequency - Lower: 10MHz; Frequency - Upper: 3GHz; Isolation @ Frequency: 20dB @ 2GHz (typ); Insertion Loss @ Frequency: 0.5dB @ 2GHz; IIP3: 55dBm (typ); Topology: Reflective; P1dB: 29dBm (typ) IP1dB; Impedance: 50 Ohm; Voltage - Supply: 1.8 V ~ 3.3 V; RF Type: General Purpose; Supplier 1: Digi-Key; Manufacturer Part Number: 4259-63; RoHS: RoHS Compliant; Category: RF/IF and RFID; Stock 1: 190923; Pricing 1: 1=0.57, 101=0.45802, 1000=0.37874 (EUR); Packaging: Digi-Reel®; Circuit: SPDT; Features: Single/Dual Line Control; Operating Temperature: -40°C ~ 85°C; Package / Case: 6-TSSOP, SC-88, SOT-363; Supplier Device Package: SC-70-6; ComponentLink1URL: http://www.psemi.com/pdf/datasheets/pe4259ds.pdf; ComponentLink1Description: http://www.psemi.com/pdf/datasheets/pe4259ds.pdf; Supplier Part Number 1: 1046-1011-6-ND
U9 = SX1276IMLTRT: IC 137-1050MHX TXRX; Manufacturer: Semtech Corporation; RF Family/Standard: General ISM < 1GHz; Modulation: FSK, GFSK, GMSK, LoRa™, MSK, OOK; Frequency: 137MHz ~ 1.02GHz; Data Rate (Max): 300kbps; Power - Output: 20dBm; Sensitivity: -137dBm; Serial Interfaces: SPI; Voltage - Supply: 1.8 V ~ 3.7 V; Current - Receiving: 13mA; Current - Transmitting: 28mA; Supplier 1: Digi-Key; Manufacturer Part Number: SX1276IMLTRT; RoHS: RoHS Compliant; Category: RF/IF and RFID; Stock 1: 8423; Pricing 1: 1=7.42, 10=6.669, 25=6.0664, 100=5.4911, 250=5.03112, 500=4.59988, 1000=3.99615 (EUR); Packaging: Digi-Reel®; Type: TxRx Only; Protocol: -; Memory Size: -; GPIO: -; Operating Temperature: -40°C ~ 85°C; Package / Case: 28-VQFN Exposed Pad; ComponentLink1URL: http://www.semtech.com/images/datasheet/sx1276.pdf; ComponentLink1Description: http://www.semtech.com/images/datasheet/sx1276.pdf; Supplier Part Number 1: SX1276IMLTRTDKR-ND
U11 = NC7SZ04P5X: IC INVERTER UHS SINGLE SC70-5; Manufacturer: Fairchild Semiconductor; Number of Circuits: 1; Voltage - Supply: 1.65 V ~ 5.5 V; Current - Quiescent (Max): 2µA; Current - Output High, Low: 32mA, 32mA; Max Propagation Delay @ V, Max CL: 4.3ns @ 5V, 50pF; Supplier 1: Digi-Key; Manufacturer Part Number: NC7SZ04P5X; RoHS: RoHS Compliant; Category: Integrated Circuits (ICs); Stock 1: 36767; Pricing 1: 1=0.31, 10=0.252, 100=0.1334, 500=0.08772, 1000=0.05976 (EUR); Packaging: Digi-Reel®; Logic Type: Inverter; Number of Inputs: 1; Features: -; Logic Level - Low: -; Logic Level - High: -; Operating Temperature: -40°C ~ 85°C; Mounting Type: Surface Mount; Supplier Device Package: SC-70-5; Package / Case: 5-TSSOP, SC-70-5, SOT-353; ComponentLink1URL: http://www.fairchildsemi.com/datasheets/NC/NC7SZ04.pdf; ComponentLink1Description: http://www.fairchildsemi.com/datasheets/NC/NC7SZ04.pdf; Supplier Part Number 1: NC7SZ04P5XDKR-ND
X3 = NX2520SA-32.000000MHZ: CRYSTAL 32.0000MHZ 10PF SMD; Manufacturer: NDK; Frequency: 32MHz; Frequency Stability: ±10ppm; ESR (Equivalent Series Resistance): 50 Ohm; Operating Mode: Fundamental; Value: 32MHz; Supplier 1: Digi-Key; Manufacturer Part Number: NX2520SA-32.000000MHZ; RoHS: RoHS Compliant; Category: Crystals and Oscillators; Stock 1: 91241; Pricing 1: 1=1.09, 10=1.043, 50=1.02, 100=0.8723, 500=0.84924, 1000=0.71539 (EUR); Packaging: Digi-Reel®; Type: MHz Crystal; Frequency Tolerance: ±10ppm; Load Capacitance: 10pF; Operating Temperature: -10°C ~ 60°C; Ratings: -; Mounting Type: Surface Mount; Package / Case: 4-SMD, No Lead (DFN, LCC); Size / Dimension: 0.098" L x 0.079" W (2.50mm x 2.00mm); Height: 0.026" (0.65mm); ComponentLink1URL: http://media.digikey.com/pdf/Data%20Sheets/NDK%20PDFs/NX2520SA_16-48MHZ.pdf; ComponentLink1Description: http://media.digikey.com/pdf/Data%20Sheets/NDK%20PDFs/NX2520SA_16-48MHZ.pdf; Supplier Part Number 1: 644-1065-6-ND